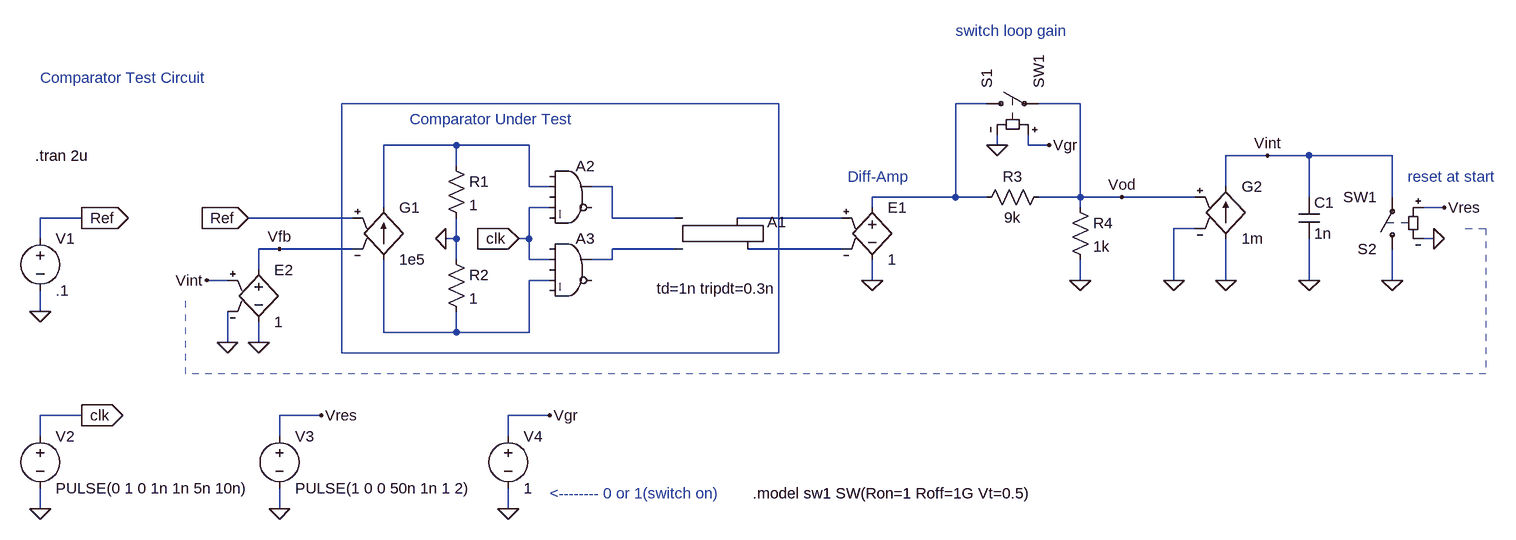
[diagram p0: schematic comparator_test2.asc]
comparator_test2.asc, the LTspice schematic file:
Version 4
SHEET 1 1860 680
WIRE 1040 -80 992 -80
WIRE 1184 -80 1120 -80
WIRE 224 -16 112 -16
WIRE 336 -16 224 -16
WIRE 1056 -16 1056 -32
WIRE 1104 -16 1104 -32
WIRE 1136 -16 1104 -16
WIRE 1472 0 1408 0
WIRE 1536 0 1472 0
WIRE 1664 0 1536 0
WIRE 224 16 224 -16
WIRE 336 48 336 -16
WIRE 368 48 336 48
WIRE 464 48 432 48
WIRE 1408 48 1408 0
WIRE 992 64 992 -80
WIRE 992 64 864 64
WIRE 1040 64 992 64
WIRE 1184 64 1184 -80
WIRE 1184 64 1120 64
WIRE 1248 64 1184 64
WIRE 1360 64 1248 64
WIRE 1536 64 1536 0
WIRE 1664 64 1664 0
WIRE 112 80 112 -16
WIRE 368 80 336 80
WIRE 864 80 864 64
WIRE 1184 80 1184 64
WIRE 1744 80 1712 80
WIRE -352 96 -416 96
WIRE 64 96 -96 96
WIRE 464 96 464 48
WIRE 560 96 464 96
WIRE 816 96 656 96
WIRE 1360 112 1328 112
WIRE -416 128 -416 96
WIRE 224 128 224 96
WIRE 224 128 208 128
WIRE 336 128 336 80
WIRE 336 128 320 128
WIRE 1728 128 1712 128
WIRE -48 144 -80 144
WIRE 64 144 -48 144
WIRE 560 144 464 144
WIRE 816 144 672 144
WIRE 224 160 224 128
WIRE 336 160 336 128
WIRE 368 160 336 160
WIRE 464 160 464 144
WIRE 464 160 432 160
WIRE -80 176 -80 144
WIRE -128 192 -160 192
WIRE 368 192 336 192
WIRE 864 192 864 160
WIRE 1184 192 1184 160
WIRE 1328 192 1328 112
WIRE 1408 192 1408 128
WIRE 1536 192 1536 128
WIRE 1664 192 1664 144
WIRE -416 240 -416 208
WIRE 112 272 112 160
WIRE 224 272 224 240
WIRE 224 272 112 272
WIRE 336 272 336 192
WIRE 336 272 224 272
WIRE -128 288 -128 240
WIRE -80 288 -80 256
WIRE -352 400 -416 400
WIRE 16 400 -48 400
WIRE 368 400 304 400
WIRE -416 432 -416 400
WIRE -48 432 -48 400
WIRE 304 432 304 400
WIRE -416 544 -416 512
WIRE -48 544 -48 512
WIRE 304 544 304 512
FLAG 208 128 0
FLAG 320 128 clk
IOPIN 320 128 In
FLAG 864 192 0
FLAG 1248 64 Vod
FLAG -96 96 Ref
IOPIN -96 96 In
FLAG -416 240 0
FLAG -416 544 0
FLAG -352 96 Ref
IOPIN -352 96 Out
FLAG -352 400 clk
IOPIN -352 400 Out
FLAG -48 144 Vfb
FLAG 1184 192 0
FLAG 1056 -16 0
FLAG 1136 -16 Vgr
FLAG 1328 192 0
FLAG 1408 192 0
FLAG 1536 192 0
FLAG 1728 128 0
FLAG 1744 80 Vres
FLAG 1664 192 0
FLAG -80 288 0
FLAG -128 288 0
FLAG 1472 0 Vint
FLAG -160 192 Vint
FLAG -48 544 0
FLAG 16 400 Vres
FLAG 304 544 0
FLAG 368 400 Vgr
SYMBOL Digital\\srflop 608 48 R0
WINDOW 39 -76 157 Left 0
SYMATTR SpiceLine td=1n tripdt=0.3n
SYMATTR InstName A1
SYMBOL Digital\\and 400 0 R0
SYMATTR InstName A2
SYMBOL Digital\\and 400 112 R0
SYMATTR InstName A3
SYMBOL res 208 0 R0
SYMATTR InstName R1
SYMATTR Value 1
SYMBOL res 208 144 R0
SYMATTR InstName R2
SYMATTR Value 1
SYMBOL g 112 64 R0
SYMATTR InstName G1
SYMATTR Value 1e5
SYMBOL e 864 64 R0
SYMATTR InstName E1
SYMATTR Value 1
SYMBOL voltage -416 112 R0
SYMATTR InstName V1
SYMATTR Value .1
SYMBOL voltage -416 416 R0
WINDOW 123 0 0 Left 0
WINDOW 39 0 0 Left 0
SYMATTR InstName V2
SYMATTR Value PULSE(0 1 0 1n 1n 5n 10n)
SYMBOL res 1024 80 R270
WINDOW 0 32 56 VTop 0
WINDOW 3 0 56 VBottom 0
SYMATTR InstName R3
SYMATTR Value 9k
SYMBOL res 1168 64 R0
SYMATTR InstName R4
SYMATTR Value 1k
SYMBOL sw 1024 -80 R270
SYMATTR InstName S1
SYMATTR Value SW1
SYMBOL g 1408 32 R0
SYMATTR InstName G2
SYMATTR Value 1m
SYMBOL sw 1664 160 R180
SYMATTR InstName S2
SYMATTR Value SW1
SYMBOL cap 1520 64 R0
SYMATTR InstName C1
SYMATTR Value 1n
SYMBOL e -80 160 R0
SYMATTR InstName E2
SYMATTR Value 1
SYMBOL voltage -48 416 R0
WINDOW 123 0 0 Left 0
WINDOW 39 0 0 Left 0
SYMATTR InstName V3
SYMATTR Value PULSE(1 0 0 50n 1n 1 2)
SYMBOL voltage 304 416 R0
WINDOW 123 0 0 Left 0
WINDOW 39 0 0 Left 0
SYMATTR InstName V4
SYMATTR Value 1
TEXT -424 0 Left 0 !.tran 2u
TEXT -416 -120 Left 0 ;Comparator Test Circuit
TEXT 920 32 Right 0 ;Diff-Amp
TEXT 152 -56 Left 0 ;Comparator Under Test
TEXT 680 520 Left 0 !.model sw1 SW(Ron=1 Roff=1G Vt=0.5)
TEXT 368 520 Left 0 ;<-------- 0 or 1(switch on)
TEXT 992 -192 Left 0 ;switch loop gain
TEXT 1688 32 Left 0 ;reset at start
LINE Normal -192 224 -192 224 2
LINE Normal -192 336 -192 224 2
LINE Normal 1808 336 -192 336 2
LINE Normal 1808 112 1808 336 2
LINE Normal 1776 112 1808 112 2
RECTANGLE Normal 720 304 48 -80

The netlist it stands for:
* comparator_test2.asc
A1 N003 N005 0 0 0 N006 N004 0 SRFLOP td=1n tripdt=0.3n
A2 0 N002 0 clk 0 0 N003 0 AND
A3 0 clk 0 N007 0 0 N005 0 AND
R1 N002 0 1
R2 0 N007 1
G1 N007 N002 Ref Vfb 1e5
E1 N001 0 N004 N006 1
V1 Ref 0 .1
V2 clk 0 PULSE(0 1 0 1n 1n 5n 10n)
R3 N001 Vod 9k
R4 Vod 0 1k
S1 N001 Vod Vgr 0 SW1
G2 0 Vint Vod 0 1m
S2 0 Vint Vres 0 SW1
C1 Vint 0 1n
E2 Vfb 0 Vint 0 1
V3 Vres 0 PULSE(1 0 0 50n 1n 1 2)
V4 Vgr 0 1
.tran 2u
* Comparator Test Circuit
* Diff-Amp
* Comparator Under Test
.model sw1 SW(Ron=1 Roff=1G Vt=0.5)
* <-------- 0 or 1(switch on)
* switch loop gain
* reset at start
.backanno
.end